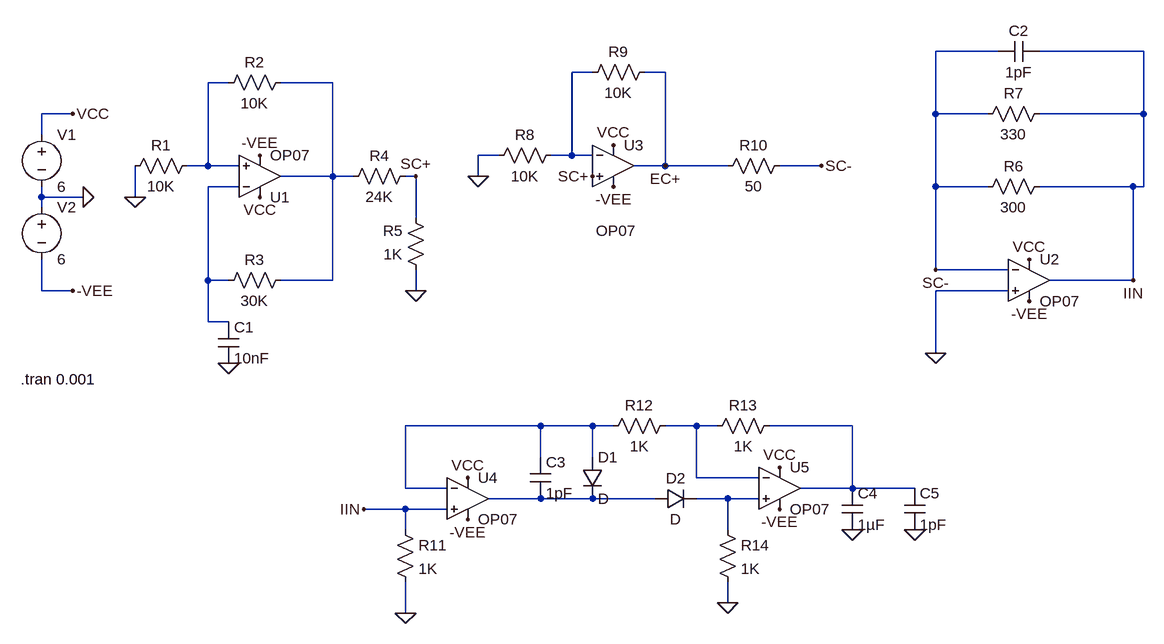
[diagram p0: schematic EC_meter_corrected_simulation.asc]
EC_meter_corrected_simulation.asc, the LTspice schematic file:
Version 4
SHEET 1 1604 820
WIRE 1360 -64 1264 -64
WIRE 1584 -64 1424 -64
WIRE 736 -32 704 -32
WIRE 848 -32 816 -32
WIRE 176 -16 144 -16
WIRE 336 -16 256 -16
WIRE -64 32 -112 32
WIRE 1264 32 1264 -64
WIRE 1344 32 1264 32
WIRE 1584 32 1584 -64
WIRE 1584 32 1424 32
WIRE -112 64 -112 32
WIRE 592 96 560 96
WIRE 704 96 704 -32
WIRE 704 96 672 96
WIRE 736 96 704 96
WIRE 144 112 144 -16
WIRE 144 112 112 112
WIRE 192 112 144 112
WIRE 848 112 848 -32
WIRE 848 112 800 112
WIRE 944 112 848 112
WIRE 1088 112 1024 112
WIRE 336 128 336 -16
WIRE 336 128 256 128
WIRE 368 128 336 128
WIRE 464 128 448 128
WIRE 560 128 560 96
WIRE 192 144 144 144
WIRE 1264 144 1264 32
WIRE 1344 144 1264 144
WIRE 1568 144 1424 144
WIRE 1584 144 1584 32
WIRE 1584 144 1568 144
WIRE -112 160 -112 144
WIRE -48 160 -112 160
WIRE 32 160 32 112
WIRE -112 176 -112 160
WIRE 464 192 464 128
WIRE 1264 272 1264 144
WIRE 1376 272 1264 272
WIRE 144 288 144 144
WIRE 176 288 144 288
WIRE 336 288 336 128
WIRE 336 288 256 288
WIRE 1568 288 1568 144
WIRE 1568 288 1440 288
WIRE -112 304 -112 256
WIRE -64 304 -112 304
WIRE 464 304 464 272
WIRE 1376 304 1264 304
WIRE 144 352 144 288
WIRE 176 352 144 352
WIRE 1264 400 1264 304
WIRE 656 512 448 512
WIRE 736 512 656 512
WIRE 768 512 736 512
WIRE 896 512 848 512
WIRE 928 512 896 512
WIRE 1136 512 1008 512
WIRE 656 560 656 512
WIRE 736 560 736 512
WIRE 896 592 896 512
WIRE 992 592 896 592
WIRE 448 608 448 512
WIRE 512 608 448 608
WIRE 1136 608 1136 512
WIRE 1136 608 1056 608
WIRE 1232 608 1136 608
WIRE 656 624 576 624
WIRE 736 624 656 624
WIRE 832 624 736 624
WIRE 944 624 896 624
WIRE 992 624 944 624
WIRE 448 640 384 640
WIRE 512 640 448 640
WIRE 448 672 448 640
WIRE 944 672 944 624
WIRE 944 784 944 752
WIRE 448 800 448 752
FLAG -48 160 0
FLAG -64 32 VCC
FLAG -64 304 -VEE
FLAG 224 96 -VEE
FLAG 224 160 VCC
FLAG 176 416 0
FLAG 32 160 0
FLAG 464 304 0
FLAG 1264 400 0
FLAG 1408 256 VCC
FLAG 1408 320 -VEE
FLAG 1264 272 SC-
FLAG 560 128 0
FLAG 464 128 SC+
FLAG 736 128 SC+
FLAG 768 80 VCC
FLAG 768 144 -VEE
FLAG 848 112 EC+
FLAG 1088 112 SC-
FLAG 1568 288 IIN
FLAG 448 800 0
FLAG 384 640 IIN
FLAG 944 784 0
FLAG 544 592 VCC
FLAG 544 656 -VEE
FLAG 1024 576 VCC
FLAG 1024 640 -VEE
FLAG 1136 672 0
FLAG 1232 672 0
SYMBOL OpAmps\\OP07 224 192 M180
SYMATTR InstName U1
SYMBOL voltage -112 48 R0
SYMATTR InstName V1
SYMATTR Value 6
SYMBOL voltage -112 160 R0
SYMATTR InstName V2
SYMATTR Value 6
SYMBOL res 128 96 R90
WINDOW 0 0 56 VBottom 2
WINDOW 3 32 56 VTop 2
SYMATTR InstName R1
SYMATTR Value 10K
SYMBOL res 272 -32 R90
WINDOW 0 0 56 VBottom 2
WINDOW 3 32 56 VTop 2
SYMATTR InstName R2
SYMATTR Value 10K
SYMBOL res 272 272 R90
WINDOW 0 0 56 VBottom 2
WINDOW 3 32 56 VTop 2
SYMATTR InstName R3
SYMATTR Value 30K
SYMBOL cap 160 352 R0
SYMATTR InstName C1
SYMATTR Value 10nF
SYMBOL res 464 112 R90
WINDOW 0 0 56 VBottom 2
WINDOW 3 32 56 VTop 2
SYMATTR InstName R4
SYMATTR Value 24K
SYMBOL res 480 288 R180
WINDOW 0 36 76 Left 2
WINDOW 3 36 40 Left 2
SYMATTR InstName R5
SYMATTR Value 1K
SYMBOL OpAmps\\OP07 1408 224 R0
SYMATTR InstName U2
SYMBOL res 1440 128 R90
WINDOW 0 0 56 VBottom 2
WINDOW 3 32 56 VTop 2
SYMATTR InstName R6
SYMATTR Value 300
SYMBOL res 1440 16 R90
WINDOW 0 0 56 VBottom 2
WINDOW 3 32 56 VTop 2
SYMATTR InstName R7
SYMATTR Value 330
SYMBOL cap 1424 -80 R90
WINDOW 0 0 32 VBottom 2
WINDOW 3 32 32 VTop 2
SYMATTR InstName C2
SYMATTR Value 1pF
SYMBOL OpAmps\\OP07 768 48 R0
WINDOW 3 -27 164 Left 2
SYMATTR InstName U3
SYMBOL res 688 80 R90
WINDOW 0 0 56 VBottom 2
WINDOW 3 32 56 VTop 2
SYMATTR InstName R8
SYMATTR Value 10K
SYMBOL res 832 -48 R90
WINDOW 0 0 56 VBottom 2
WINDOW 3 32 56 VTop 2
SYMATTR InstName R9
SYMATTR Value 10K
SYMBOL res 1040 96 R90
WINDOW 0 0 56 VBottom 2
WINDOW 3 32 56 VTop 2
SYMATTR InstName R10
SYMATTR Value 50
SYMBOL OpAmps\\OP07 544 560 R0
SYMATTR InstName U4
SYMBOL OpAmps\\OP07 1024 544 R0
SYMATTR InstName U5
SYMBOL cap 640 560 R0
SYMATTR InstName C3
SYMATTR Value 1pF
SYMBOL diode 720 560 R0
SYMATTR InstName D1
SYMBOL diode 832 640 R270
WINDOW 0 32 32 VTop 2
WINDOW 3 0 32 VBottom 2
SYMATTR InstName D2
SYMBOL res 432 656 R0
SYMATTR InstName R11
SYMATTR Value 1K
SYMBOL res 864 496 R90
WINDOW 0 0 56 VBottom 2
WINDOW 3 32 56 VTop 2
SYMATTR InstName R12
SYMATTR Value 1K
SYMBOL res 1024 496 R90
WINDOW 0 0 56 VBottom 2
WINDOW 3 32 56 VTop 2
SYMATTR InstName R13
SYMATTR Value 1K
SYMBOL res 928 656 R0
SYMATTR InstName R14
SYMATTR Value 1K
SYMBOL cap 1120 608 R0
SYMATTR InstName C4
SYMATTR Value 1µF
SYMBOL cap 1216 608 R0
SYMATTR InstName C5
SYMATTR Value 1pF
TEXT -144 440 Left 2 !.tran 0.001

The netlist it stands for:
* EC_meter_corrected_simulation.asc
XU1 N002 N004 VCC -VEE N003 LT1001  ; OP07, pins In+ In- V+ V- OUT
V1 VCC 0 6
V2 0 -VEE 6
R1 N002 0 10K
R2 N003 N002 10K
R3 N003 N004 30K
C1 N004 0 10nF
R4 SC+ N003 24K
R5 0 SC+ 1K
XU2 0 SC- VCC -VEE IIN LT1001  ; OP07, pins In+ In- V+ V- OUT
R6 IIN SC- 300
R7 IIN SC- 330
C2 IIN SC- 1pF
XU3 SC+ N001 VCC -VEE EC+ LT1001  ; OP07, pins In+ In- V+ V- OUT
R8 N001 0 10K
R9 EC+ N001 10K
R10 SC- EC+ 50
XU4 IIN N005 VCC -VEE N008 LT1001  ; OP07, pins In+ In- V+ V- OUT
XU5 N009 N006 VCC -VEE N007 LT1001  ; OP07, pins In+ In- V+ V- OUT
C3 N005 N008 1pF
D1 N005 N008 D
D2 N008 N009 D
R11 IIN 0 1K
R12 N006 N005 1K
R13 N007 N006 1K
R14 N009 0 1K
C4 N007 0 1µF
C5 N007 0 1pF
.model D D
.lib standard.dio
.tran 0.001
.lib LTC.lib
.backanno
.end